# EAGLE design Adafruit NeoPixel Ring 24 rev C (EAGLE 9.6.2)
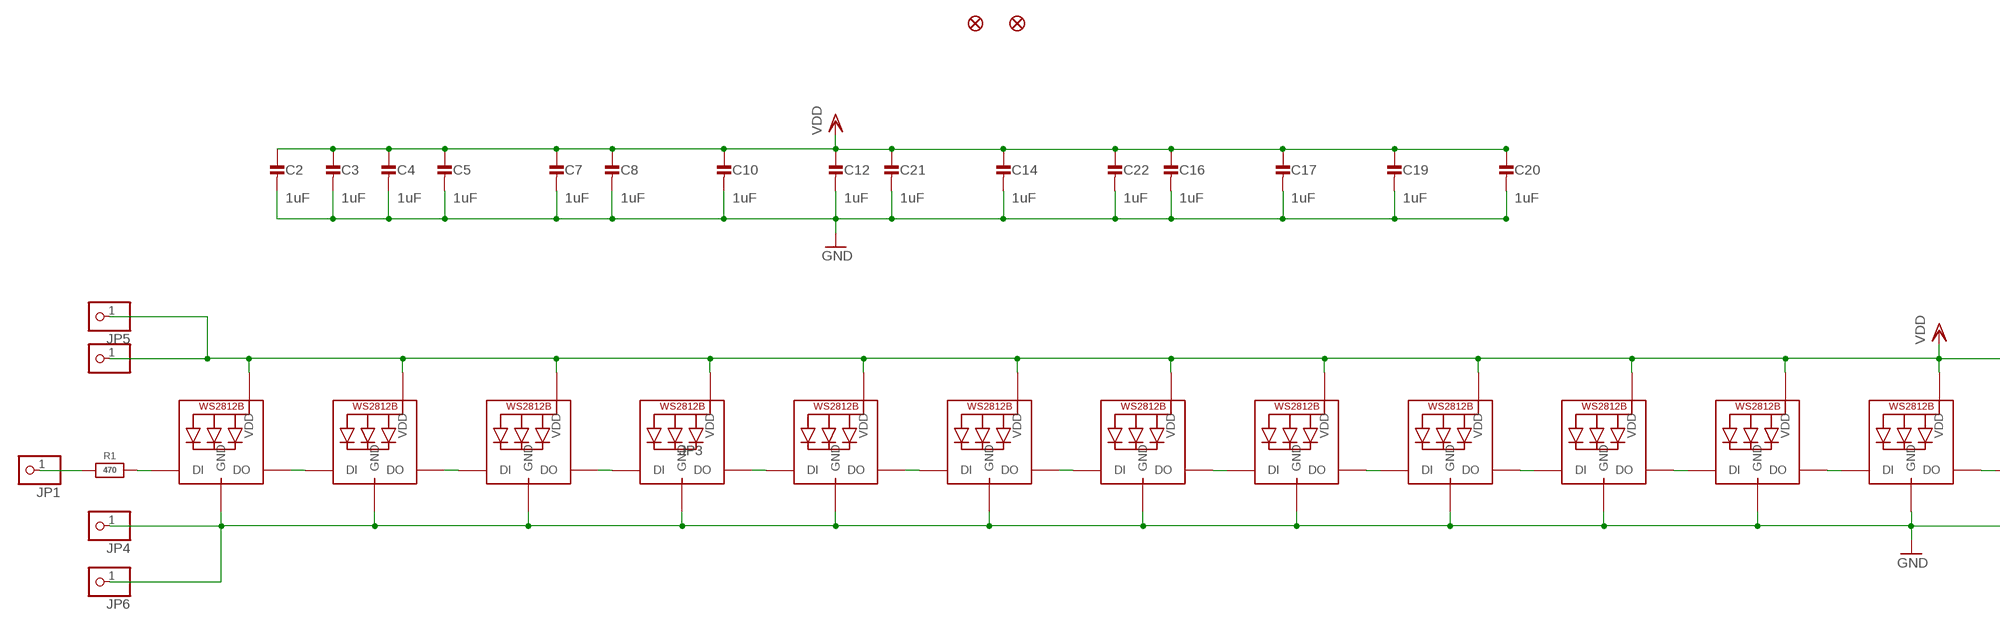
[diagram p0: schematic, sheet 1, part 1 of 2]
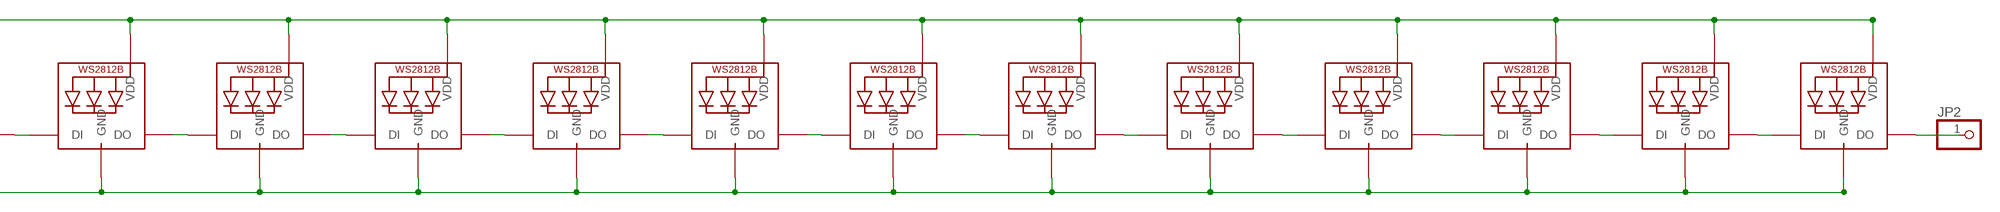
[diagram p1: schematic, sheet 1, part 2 of 2]

## Parts
C2  1uF  CAP_CERAMIC0603_NO  [0603-NO]
C3  1uF  CAP_CERAMIC0603_NO  [0603-NO]
C4  1uF  CAP_CERAMIC0603_NO  [0603-NO]
C5  1uF  CAP_CERAMIC0603_NO  [0603-NO]
C7  1uF  CAP_CERAMIC0603_NO  [0603-NO]
C8  1uF  CAP_CERAMIC0603_NO  [0603-NO]
C10  1uF  CAP_CERAMIC0603_NO  [0603-NO]
C12  1uF  CAP_CERAMIC0603_NO  [0603-NO]
C14  1uF  CAP_CERAMIC0603_NO  [0603-NO]
C16  1uF  CAP_CERAMIC0603_NO  [0603-NO]
C17  1uF  CAP_CERAMIC0603_NO  [0603-NO]
C19  1uF  CAP_CERAMIC0603_NO  [0603-NO]
C20  1uF  CAP_CERAMIC0603_NO  [0603-NO]
C21  1uF  CAP_CERAMIC0603_NO  [0603-NO]
C22  1uF  CAP_CERAMIC0603_NO  [0603-NO]
FID1  FIDUCIAL  FIDUCIAL_1MM  [FIDUCIAL_1MM]
FID2  FIDUCIAL  FIDUCIAL_1MM  [FIDUCIAL_1MM]
JP1  PINHD-1X1CB  [1X01-CLEANBIG]
JP2  PINHD-1X1CB  [1X01-CLEANBIG]
JP3  PINHD-1X1CB  [1X01-CLEANBIG]
JP4  PINHD-1X1CB  [1X01-CLEANBIG]
JP5  PINHD-1X1CB  [1X01-CLEANBIG]
JP6  PINHD-1X1CB  [1X01-CLEANBIG]
LED1  WS2812B_5050N  [WS2812B-NARROW]
LED2  WS2812B_5050N  [WS2812B-NARROW]
LED3  WS2812B_5050N  [WS2812B-NARROW]
LED4  WS2812B_5050N  [WS2812B-NARROW]
LED5  WS2812B_5050N  [WS2812B-NARROW]
LED6  WS2812B_5050N  [WS2812B-NARROW]
LED7  WS2812B_5050N  [WS2812B-NARROW]
LED8  WS2812B_5050N  [WS2812B-NARROW]
LED9  WS2812B_5050N  [WS2812B-NARROW]
LED10  WS2812B_5050N  [WS2812B-NARROW]
LED11  WS2812B_5050N  [WS2812B-NARROW]
LED12  WS2812B_5050N  [WS2812B-NARROW]
LED13  WS2812B_5050N  [WS2812B-NARROW]
LED14  WS2812B_5050N  [WS2812B-NARROW]
LED15  WS2812B_5050N  [WS2812B-NARROW]
LED16  WS2812B_5050N  [WS2812B-NARROW]
LED17  WS2812B_5050N  [WS2812B-NARROW]
LED18  WS2812B_5050N  [WS2812B-NARROW]
LED19  WS2812B_5050N  [WS2812B-NARROW]
LED20  WS2812B_5050N  [WS2812B-NARROW]
LED21  WS2812B_5050N  [WS2812B-NARROW]
LED22  WS2812B_5050N  [WS2812B-NARROW]
LED23  WS2812B_5050N  [WS2812B-NARROW]
LED24  WS2812B_5050N  [WS2812B-NARROW]
R1  470  RESISTOR_0603_NOOUT  [0603-NO]

## Nets
GND: C2.2 C3.2 C4.2 C5.2 C7.2 C8.2 C10.2 C12.2 C14.2 C16.2 C17.2 C19.2 C20.2 C21.2 C22.2 JP4.1 JP6.1 LED1.3-GND(GND) LED2.3-GND(GND) LED3.3-GND(GND) LED4.3-GND(GND) LED5.3-GND(GND) LED6.3-GND(GND) LED7.3-GND(GND) LED8.3-GND(GND) LED9.3-GND(GND) LED10.3-GND(GND) LED11.3-GND(GND) LED12.3-GND(GND) LED13.3-GND(GND) LED14.3-GND(GND) LED15.3-GND(GND) LED16.3-GND(GND) LED17.3-GND(GND) LED18.3-GND(GND) LED19.3-GND(GND) LED20.3-GND(GND) LED21.3-GND(GND) LED22.3-GND(GND) LED23.3-GND(GND) LED24.3-GND(GND)
N$1: LED1.2-DOUT(DO) LED2.4-DIN(DI)
N$2: LED2.2-DOUT(DO) LED3.4-DIN(DI)
N$3: LED3.2-DOUT(DO) LED4.4-DIN(DI)
N$4: LED4.2-DOUT(DO) LED5.4-DIN(DI)
N$5: LED5.2-DOUT(DO) LED6.4-DIN(DI)
N$6: LED6.2-DOUT(DO) LED7.4-DIN(DI)
N$7: LED7.2-DOUT(DO) LED8.4-DIN(DI)
N$8: LED8.2-DOUT(DO) LED9.4-DIN(DI)
N$9: LED9.2-DOUT(DO) LED10.4-DIN(DI)
N$10: LED10.2-DOUT(DO) LED11.4-DIN(DI)
N$11: LED11.2-DOUT(DO) LED12.4-DIN(DI)
N$12: LED12.2-DOUT(DO) LED13.4-DIN(DI)
N$13: LED13.2-DOUT(DO) LED14.4-DIN(DI)
N$14: LED14.2-DOUT(DO) LED15.4-DIN(DI)
N$15: LED15.2-DOUT(DO) LED16.4-DIN(DI)
N$16: LED16.2-DOUT(DO) LED17.4-DIN(DI)
N$17: LED17.2-DOUT(DO) LED18.4-DIN(DI)
N$18: LED18.2-DOUT(DO) LED19.4-DIN(DI)
N$19: LED19.2-DOUT(DO) LED20.4-DIN(DI)
N$20: LED20.2-DOUT(DO) LED21.4-DIN(DI)
N$21: LED21.2-DOUT(DO) LED22.4-DIN(DI)
N$22: LED22.2-DOUT(DO) LED23.4-DIN(DI)
N$23: LED23.2-DOUT(DO) LED24.4-DIN(DI)
N$24: JP2.1 LED24.2-DOUT(DO)
N$25: LED1.4-DIN(DI) R1.2
N$26: JP1.1 R1.1
VDD: C2.1 C3.1 C4.1 C5.1 C7.1 C8.1 C10.1 C12.1 C14.1 C16.1 C17.1 C19.1 C20.1 C21.1 C22.1 JP3.1 JP5.1 LED1.1-VDD(VDD) LED2.1-VDD(VDD) LED3.1-VDD(VDD) LED4.1-VDD(VDD) LED5.1-VDD(VDD) LED6.1-VDD(VDD) LED7.1-VDD(VDD) LED8.1-VDD(VDD) LED9.1-VDD(VDD) LED10.1-VDD(VDD) LED11.1-VDD(VDD) LED12.1-VDD(VDD) LED13.1-VDD(VDD) LED14.1-VDD(VDD) LED15.1-VDD(VDD) LED16.1-VDD(VDD) LED17.1-VDD(VDD) LED18.1-VDD(VDD) LED19.1-VDD(VDD) LED20.1-VDD(VDD) LED21.1-VDD(VDD) LED22.1-VDD(VDD) LED23.1-VDD(VDD) LED24.1-VDD(VDD)

## Library data of the parts
C2-C5 C7 C8 C10 C12 C14 C16 C17 C19-C22 = microbuilder:CAP_CERAMIC: Ceramic Capacitors For new designs, use the packages preceded by an '_' character since they are more reliable: The following footprints should be used on most boards: _0402 - Standard footprint for regular board layouts _0603 - Standard footprint for regular board layouts _0805 - Standard footprint for regular board layouts _1206 - Standard footprint for regular board layouts For extremely tight-pitch boards where space is at a premium, the following 'micro-pitch' footprints can be used (smaller pads, no silkscreen outline, etc.): _0402MP - Micro-pitch footprint for very dense/compact boards _0603MP - Micro-pitch footprint for very dense/compact boards _0805MP - Micro-pitch footprint for very dense/compact boards _1206MP - Micro-pitch footprint for very dense/compact boards
FID1 FID2 = microbuilder:FIDUCIAL: Fiducial Alignment Points Various fiducial points for machine vision alignment.; BOM: EXCLUDE
JP1-JP6 = NeoPixelRing:PINHD-1X1: Pin header 1x1 for 0.1" spacing With round pins
LED1-LED24 = microbuilder:WS2812B; ROT: 180
R1 = microbuilder:RESISTOR: Resistors For new designs, use the packages preceded by an '_' character since they are more reliable: The following footprints should be used on most boards: _0402 - Standard footprint for regular board layouts _0603 - Standard footprint for regular board layouts _0805 - Standard footprint for regular board layouts _1206 - Standard footprint for regular board layouts For extremely tight-pitch boards where space is at a premium, the following 'micro-pitch' footprints can be used (smaller pads, no silkscreen outline, etc.): _0402MP - Micro-pitch footprint for very dense/compact boards _0603MP - Micro-pitch footprint for very dense/compact boards _0805MP - Micro-pitch footprint for very dense/compact boards _1206MP - Micro-pitch footprint for very dense/compact boards

## Board
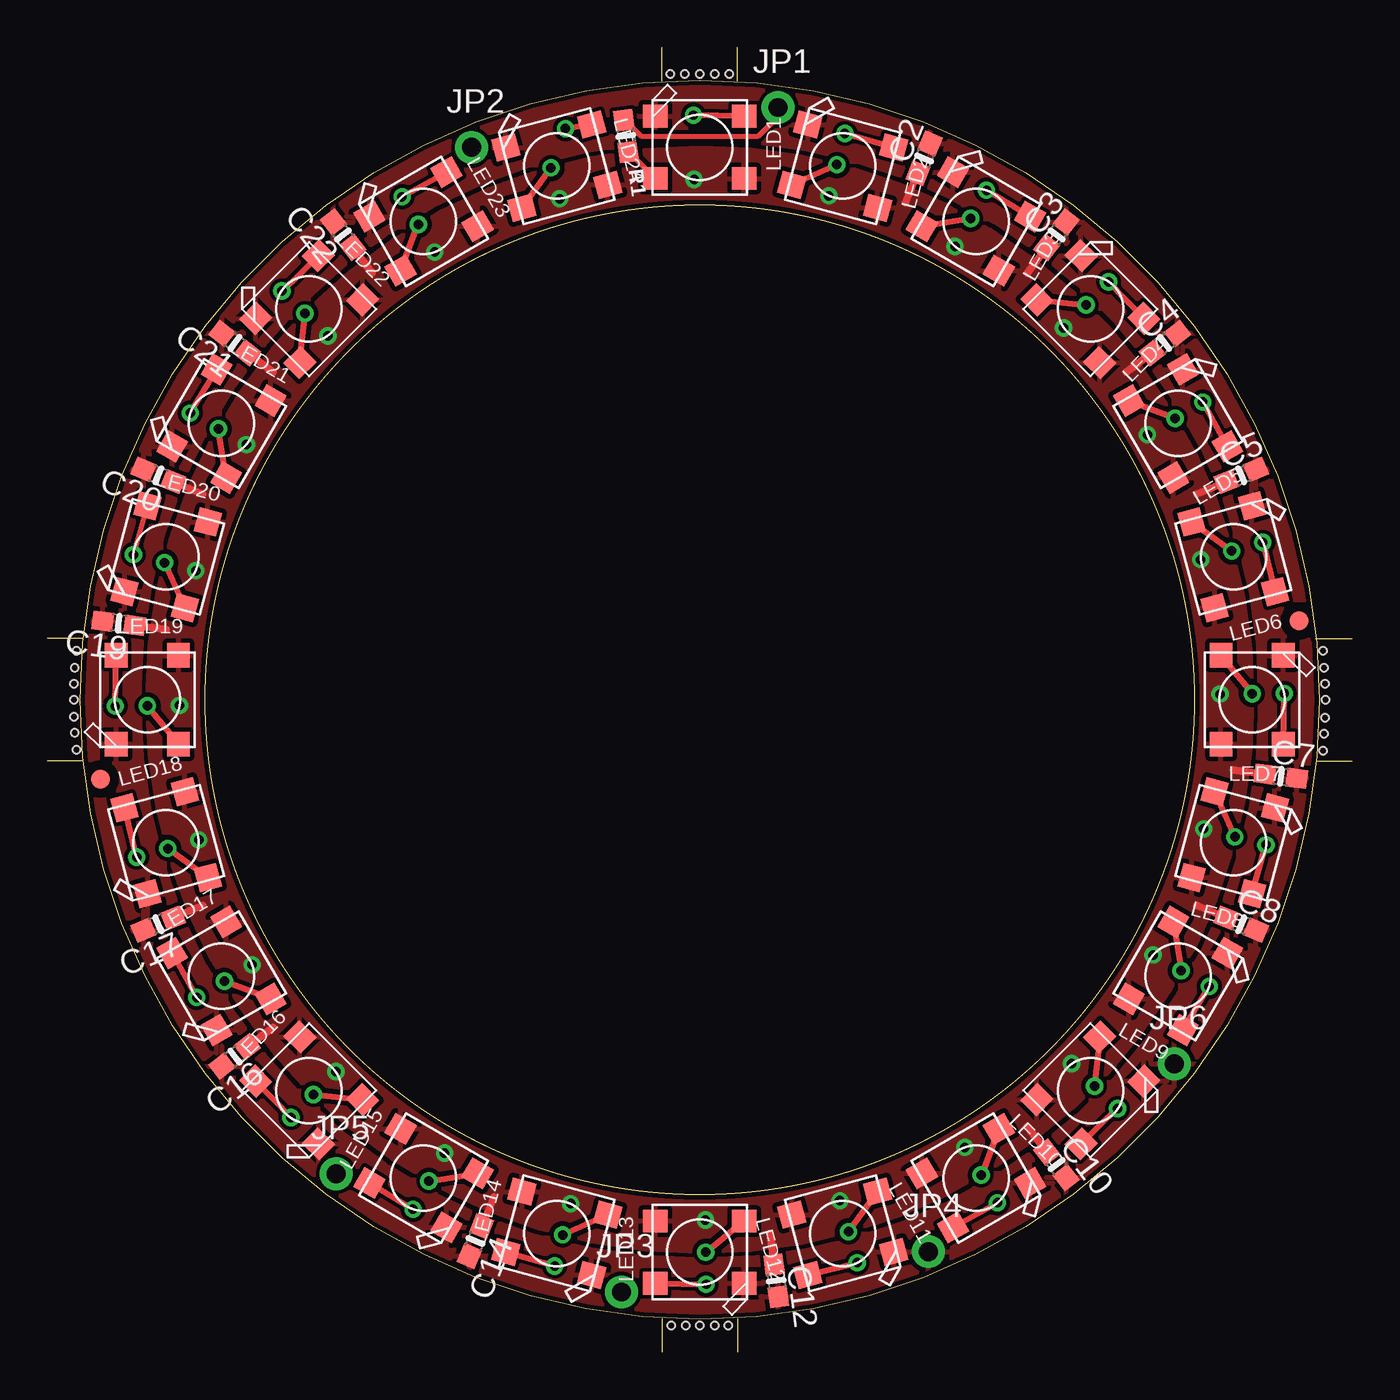
[diagram p2: board, top side]
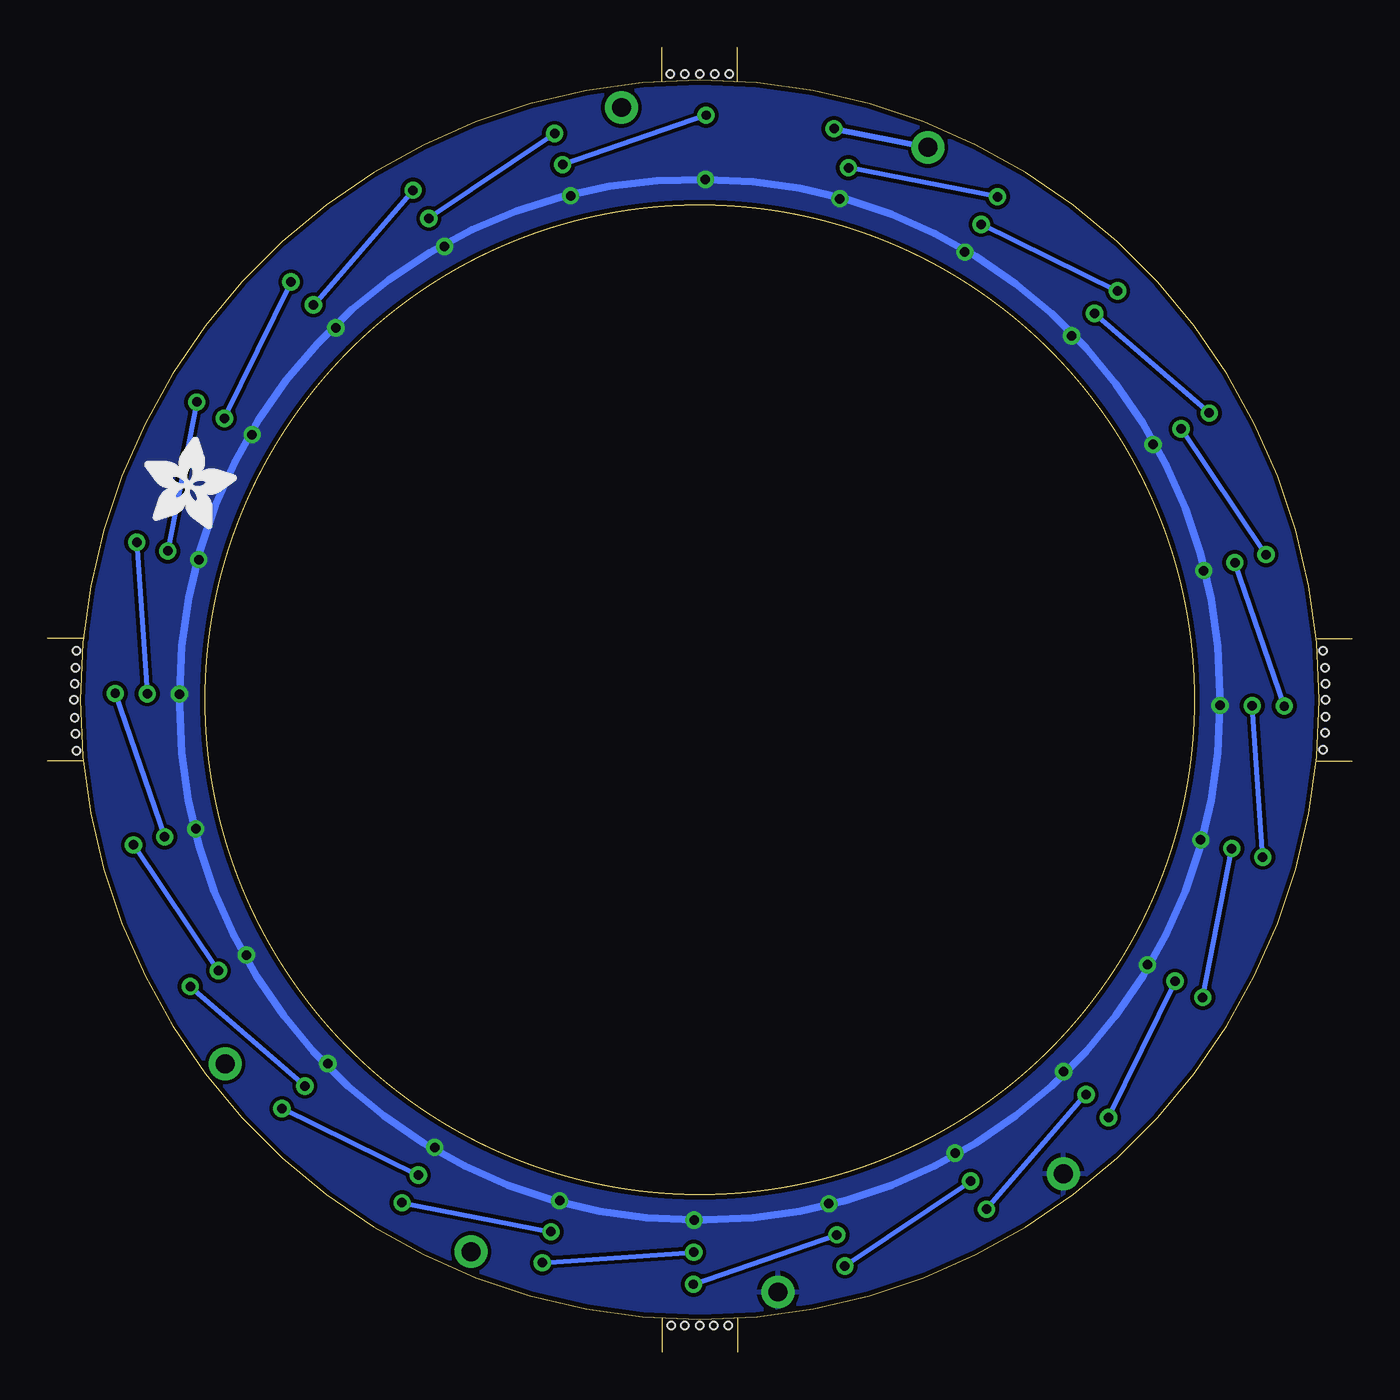
[diagram p3: board, bottom side, seen from below]

Size 69 x 69 mm. Coordinates in mm from the lower left corner, seen from the top.
Outline: 32.5,67.2 32.5,69
Outline: 1.85,37.75 0,37.75
Outline: 1.9,31.25 0,31.25
Outline: 67.05,37.75 69,37.75
Outline: 67.1,31.25 69,31.25
Outline: 36.5,67.2 36.5,69
Outline: 32.5,1.8 32.5,0
Outline: 36.5,1.8 36.5,0
Outline: 1.73,34.5 arc-90 34.5,67.27 arc-90 67.27,34.5 arc-90 34.5,1.73 arc-90 1.73,34.5
Outline: circle at 34.5,34.5 radius 26.16
Copper layers (1*16): Top 0.035mm / dielectric 1.5mm / Bottom 0.035mm
Design rules "adafruit": minimum track width 8mil, minimum drill 15.5mil, track to track 8mil, track to pad 8mil, pad to pad 8mil, via to via 8mil, smd to smd 8mil, copper to edge 10mil, drill to drill 8mil, minimum pad ring 10mil, minimum via ring 8mil, stop-mask expansion 4mil, vias tented up to drill 20mil, thermal gap 10mil
Holes 0.4 mm at 67.6,34.5 67.55,35.35 67.5,36.2 67.55,33.55 67.5,32.7 34.5,1.4 33.75,1.4 33,1.4 35.3,1.4 36,1.4 34.5,67.6 33.7,67.6 32.95,67.6 35.3,67.6 36.05,67.6 1.4,34.5 1.4,35.35 1.45,36.2 1.4,33.6 1.45,32.75 67.45,37.1 67.45,31.8 1.55,37.1 1.55,31.85

### Footprints (pad centres in the part's own frame; a part is rotated, then mirrored left to right if it is on the bottom)
0603-NO = smd 1.075 x 1: 1 -0.85,0; 2 0.85,0
FIDUCIAL_1MM = smd 1 x 1: 1 0,0
1X01-CLEANBIG = drill 1 pad 1.727: 1 0,0
WS2812B-NARROW = smd 1.3 x 1.2: 1-VDD 2.35,-1.65; 2-DOUT 2.35,1.65; 3-GND -2.35,1.65; 4-DIN -2.35,-1.65

### Placement (x,y rotation side)
C2  46.36,63.13 67.5 top
C3  53.36,59.08 52.5 top
C4  59.08,53.36 37.5 top
C5  63.13,46.36 22.5 top
C7  65.22,30.46 352.5 top
C8  63.13,22.64 337.5 top
C10  53.36,9.92 307.5 top
C12  38.54,3.78 277.5 top
C14  22.64,5.87 247.5 top
C16  9.92,15.64 217.5 top
C17  5.87,22.64 202.5 top
C19  3.78,38.54 172.5 top
C20  5.87,46.36 157.5 top
C21  9.92,53.36 142.5 top
C22  15.64,59.08 127.5 top
FID1  2.8,30.31 0 top
FID2  66.2,38.67 0 top
JP1  38.64,65.82 0 top
JP2  22.44,63.71 0 top
JP3  30.36,3.18 0 top
JP4  46.59,5.32 0 top
JP5  15.27,9.43 0 top
JP6  59.6,15.25 0 top
LED1  34.5,63.71 0 top
LED2  42.06,62.71 345 top
LED3  49.11,59.8 330 top
LED4  55.15,55.15 315 top
LED5  59.8,49.11 300 top
LED6  62.71,42.06 285 top
LED7  63.71,34.5 270 top
LED8  62.71,26.94 255 top
LED9  59.8,19.89 240 top
LED10  55.15,13.85 225 top
LED11  49.11,9.2 210 top
LED12  42.06,6.29 195 top
LED13  34.5,5.29 180 top
LED14  26.94,6.29 165 top
LED15  19.89,9.2 150 top
LED16  13.85,13.85 135 top
LED17  9.2,19.89 120 top
LED18  6.29,26.94 105 top
LED19  5.29,34.5 90 top
LED20  6.29,42.06 75 top
LED21  9.2,49.11 60 top
LED22  13.85,55.15 45 top
LED23  19.89,59.8 30 top
LED24  26.94,62.71 15 top
PLABEL0  [PLABEL0]  38.75,63.15 90 top
PLABEL1  [PLABEL1]  24.36,60.12 105 top
PLABEL2  [PLABEL2]  45.33,6.41 0 top
PLABEL3  [PLABEL3]  31.37,4.07 90 top
PLABEL4  [PLABEL4]  57.72,15.86 0 top
PLABEL5  [PLABEL5]  16.42,10.01 55 top
PLABEL6  [PLABEL6]  23.83,58.65 0 bottom
PLABEL7  [PLABEL7]  40.59,61.24 0 bottom
PLABEL8  [PLABEL8]  47.96,6.56 0 bottom
PLABEL9  [PLABEL9]  33.18,4.62 0 bottom
PLABEL10  [PLABEL10]  5.21,34.66 270 bottom
PLABEL11  [PLABEL11]  60.89,16.49 0 bottom
PLABEL12  [PLABEL12]  20.8,10.5 0 bottom
R1  30.6,64.3 277.5 top
U$1  [ADAFRUIT_5MM]  63.86,43.54 0 bottom

### Tracks (layer width: path | path; a pad name or v marks a point on that pad's centre or on a via)
GND
  pour Top (rank 2): 1.48,67.77 2.24,0.97 68.03,0.46 67.27,67.27
N$1  (via drill 0.5)
  Top 0.305: LED2.4-DIN v41.75,62.8 | LED1.2-DOUT v34.16,65.41
  Bottom 0.254: v34.16,65.41 v41.75,62.8
N$2  (via drill 0.5)
  Top 0.305: LED2.2-DOUT v42.17,64.44 | LED3.4-DIN v48.83,59.95
  Bottom 0.254: v42.17,64.44 v48.83,59.95
N$3  (via drill 0.5)
  Top 0.305: LED3.2-DOUT v49.66,61.44 | LED4.4-DIN v54.93,55.38
  Bottom 0.254: v49.66,61.44 v54.93,55.38
N$4  (via drill 0.5)
  Top 0.305: LED4.2-DOUT v56.12,56.59 | LED5.4-DIN v59.64,49.38
  Bottom 0.254: v56.12,56.59 v59.64,49.38
N$5  (via drill 0.5)
  Top 0.305: v61.1,50.25 LED5.2-DOUT | LED6.4-DIN v62.63,42.37
  Bottom 0.254: v61.1,50.25 v62.63,42.37
N$6  (via drill 0.5)
  Top 0.305: v64.27,42.83 LED6.2-DOUT | LED7.4-DIN v63.71,34.82
  Bottom 0.254: v64.27,42.83 v63.71,34.82
N$7  (via drill 0.5)
  Top 0.305: LED7.2-DOUT v65.41,34.84 | LED8.4-DIN v62.8,27.25
  Bottom 0.254: v65.41,34.84 v62.8,27.25
N$8  (via drill 0.5)
  Top 0.305: LED8.2-DOUT v64.44,26.83 | LED9.4-DIN v59.95,20.17
  Bottom 0.254: v64.44,26.83 v59.95,20.17
N$9  (via drill 0.5)
  Top 0.305: LED9.2-DOUT v61.44,19.34 | LED10.4-DIN v55.38,14.07
  Bottom 0.254: v61.44,19.34 v55.38,14.07
N$10  (via drill 0.5)
  Top 0.305: LED10.2-DOUT v56.59,12.88 | LED11.4-DIN v49.38,9.36
  Bottom 0.254: v56.59,12.88 v49.38,9.36
N$11  (via drill 0.5)
  Top 0.305: LED11.2-DOUT v50.25,7.9 | v42.37,6.37 LED12.4-DIN
  Bottom 0.254: v50.25,7.9 v42.37,6.37
N$12  (via drill 0.5)
  Top 0.305: v34.82,5.29 LED13.4-DIN | LED12.2-DOUT v42.83,4.73
  Bottom 0.254: v42.83,4.73 v34.82,5.29
N$13  (via drill 0.5)
  Top 0.305: LED13.2-DOUT v34.84,3.59 | v27.25,6.2 LED14.4-DIN
  Bottom 0.254: v34.84,3.59 v27.25,6.2
N$14  (via drill 0.5)
  Top 0.305: LED14.2-DOUT v26.83,4.56 | v20.17,9.05 LED15.4-DIN
  Bottom 0.254: v26.83,4.56 v20.17,9.05
N$15  (via drill 0.5)
  Top 0.305: LED15.2-DOUT v19.34,7.56 | v14.07,13.62 LED16.4-DIN
  Bottom 0.254: v19.34,7.56 v14.07,13.62
N$16  (via drill 0.5)
  Top 0.305: LED16.2-DOUT v12.88,12.41 | LED17.4-DIN v9.36,19.62
  Bottom 0.254: v12.88,12.41 v9.36,19.62
N$17  (via drill 0.5)
  Top 0.305: LED17.2-DOUT v7.9,18.75 | LED18.4-DIN v6.37,26.63
  Bottom 0.254: v7.9,18.75 v6.37,26.63
N$18  (via drill 0.5)
  Top 0.305: v4.73,26.18 LED18.2-DOUT | v5.29,34.18 LED19.4-DIN
  Bottom 0.254: v4.73,26.18 v5.29,34.18
N$19  (via drill 0.5)
  Top 0.305: v3.59,34.16 LED19.2-DOUT | LED20.4-DIN v6.2,41.75
  Bottom 0.254: v3.59,34.16 v6.2,41.75
N$20  (via drill 0.5)
  Top 0.254: v4.56,42.17 LED20.2-DOUT
  Top 0.305: LED21.4-DIN v9.05,48.83
  Bottom 0.254: v4.56,42.17 v9.05,48.83
N$21  (via drill 0.5)
  Top 0.305: v7.56,49.66 LED21.2-DOUT | LED22.4-DIN v13.62,54.93
  Bottom 0.254: v7.56,49.66 v13.62,54.93
N$22  (via drill 0.5)
  Top 0.305: LED22.2-DOUT v12.41,56.12 | LED23.4-DIN v19.62,59.64
  Bottom 0.254: v12.41,56.12 v19.62,59.64
N$23  (via drill 0.5)
  Top 0.305: LED24.4-DIN v26.63,62.63 | v18.75,61.1 LED23.2-DOUT
  Bottom 0.254: v18.75,61.1 v26.63,62.63
N$24  (via drill 0.5)
  Top 0.305: LED24.2-DOUT v27.4,64.7
  Bottom 0.305: v27.4,64.7 JP2.1
N$25
  Top 0.254: R1.2 30.75,63.46 LED1.4-DIN
N$26
  Top 0.254: R1.1 30.56,65.14 31.4,64.3 37.6,64.3 38.5,65.2 38.5,65.68 JP1.1
VDD  (via drill 0.5)
  Top 0.406: 45.39,60.78 45.68,61.49 C2.1 | 51.82,57.07 52.28,57.67 C3.1 | 57.07,51.82 57.67,52.28 C4.1 | 60.78,45.39 61.49,45.68 C5.1 | 62.7,30.79 63.46,30.69 C7.1 | 60.78,23.61 61.49,23.32 C8.1 | 51.82,11.93 52.28,11.33 C10.1 | 38.21,6.3 38.31,5.54 C12.1 | 23.61,8.22 23.32,7.51 C14.1 | 11.93,17.18 11.33,16.72 C16.1 | 8.22,23.61 7.51,23.32 C17.1 | 6.3,38.21 5.54,38.31 C19.1 | 8.22,45.39 7.51,45.68 C20.1 | 11.93,51.82 11.33,52.28 C21.1 | 17.18,57.07 16.72,57.67 C22.1
  Bottom 0.406: v34.2,62.01 arc90 6.99,34.8 v6.99,34.2 arc90 34.2,6.99 v34.8,6.99 arc90 62.01,34.2 v62.01,34.8 arc91 v34.2,62.01
  other vias: 41.33,61.15 47.99,58.47 53.74,54.16 58.17,48.51 60.99,41.91 61.15,27.67 58.47,21.01 54.16,15.26 48.51,10.83 41.91,8.01 27.67,7.85 21.01,10.53 15.26,14.84 10.83,20.49 8.01,27.09 7.85,41.33 10.53,47.99 14.84,53.74 20.49,58.17 27.09,60.99
  pour Bottom: 1.99,67.77 1.23,0.46 68.03,0.72 68.79,68.03
  pour Top (isolate 0.254): 34.5,63.7 arc-90 63.7,34.5 arc-90 34.5,5.3 arc-180

### Text on the board
Pinguin_tBackup: IN | OUT | G | PWR | G | PWR
Pinguin_bBackup: Data / Input | Data / Out | NeoPixel / Ring x24 | GND | PWR +5V | GND | PWR +5V